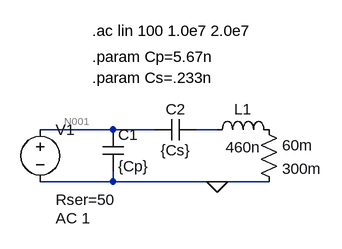
[diagram p0: schematic voltage divider.asc]
voltage divider.asc, the LTspice schematic file:
Version 4
SHEET 1 880 680
WIRE 128 128 16 128
WIRE 192 128 128 128
WIRE 288 128 256 128
WIRE 128 208 128 192
WIRE 128 208 16 208
WIRE 288 208 128 208
WIRE 368 208 288 208
FLAG 288 208 0
SYMBOL cap 112 128 R0
SYMATTR InstName C1
SYMATTR Value {Cp}
SYMBOL cap 256 112 R90
WINDOW 0 0 32 VBottom 2
WINDOW 3 32 32 VTop 2
SYMATTR InstName C2
SYMATTR Value {Cs}
SYMBOL ind 272 144 R270
WINDOW 0 32 56 VTop 2
WINDOW 3 5 56 VBottom 2
SYMATTR InstName L1
SYMATTR Value 460n
SYMBOL res 352 112 R0
SYMATTR InstName 60m
SYMATTR Value 300m
SYMBOL voltage 16 112 R0
WINDOW 123 24 152 Left 2
WINDOW 39 24 124 Left 2
SYMATTR Value2 AC 1
SYMATTR SpiceLine Rser=50
SYMATTR InstName V1
SYMATTR Value ""
TEXT 96 -24 Left 2 !.ac lin 100 1.0e7 2.0e7
TEXT 96 48 Left 2 !.param Cs=.233n
TEXT 96 16 Left 2 !.param Cp=5.67n

The netlist it stands for:
* voltage divider.asc
C1 N001 0 {Cp}
C2 N002 N001 {Cs}
L1 N002 P001 460n
R§60m P001 0 300m
V1 N001 0 AC 1 Rser=50
.ac lin 100 1.0e7 2.0e7
.param Cs=.233n
.param Cp=5.67n
.backanno
.end

* Results of the author's LTspice run, read from the files saved beside the schematic
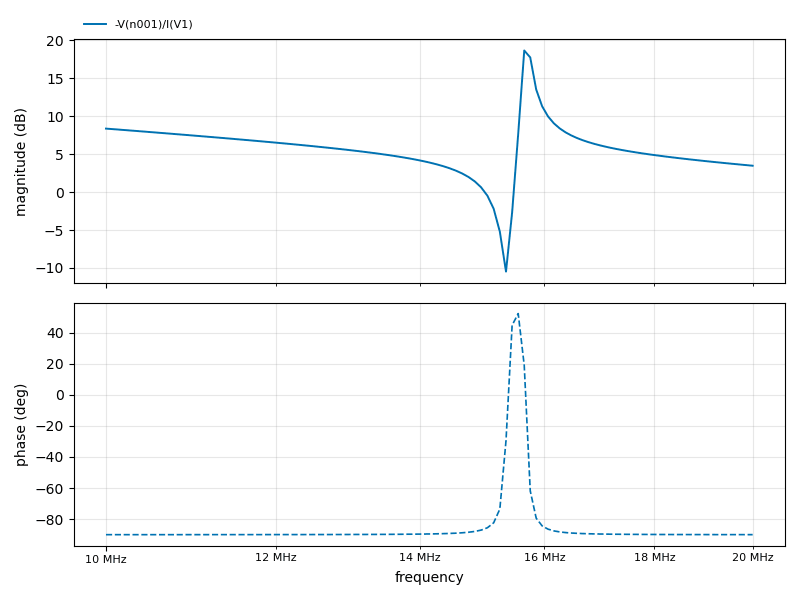
[diagram p1: AC Analysis of voltage divider.asc, plotted from the saved traces]
* AC Analysis, 1 run:
*   -V(n001)/I(V1): 8.37 dB at 10 MHz, 3.48 dB at 20 MHz, peak 18.66 dB at 15.66 MHz, 3 dB below the peak at 15.63 MHz and 15.81 MHz